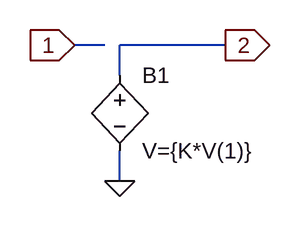
[diagram p0: schematic Gain.asc]
Gain.asc, the LTspice schematic file:
Version 4
SHEET 1 880 680
WIRE 144 112 112 112
WIRE 272 112 160 112
WIRE 160 144 160 112
WIRE 160 256 160 224
FLAG 112 112 1
IOPIN 112 112 In
FLAG 160 256 0
FLAG 272 112 2
IOPIN 272 112 Out
SYMBOL bv 160 128 R0
SYMATTR InstName B1
SYMATTR Value V={K*V(1)}

The netlist it stands for:
* Gain.asc
B1 2 0 V={K*V(1)}
.backanno
.end